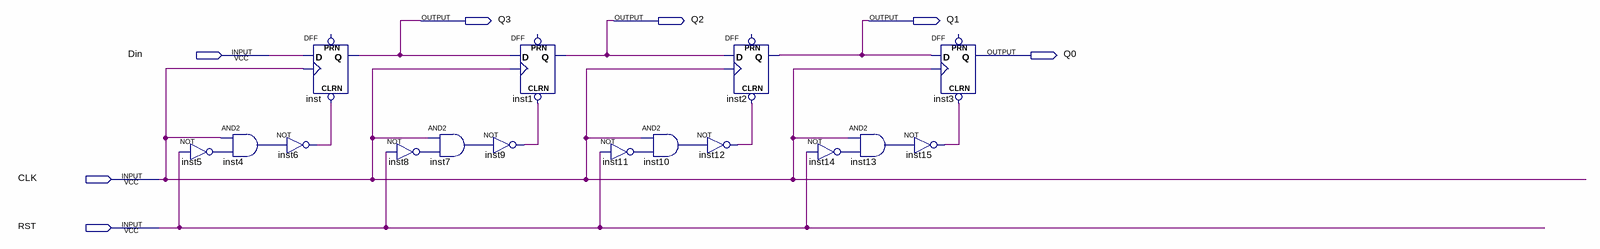
[diagram p0: schematic sheet]
// Quartus schematic four_synchronous_dff_synchronous_reset.bdf as structural Verilog: 16 symbols, 7 pins
module four_synchronous_dff_synchronous_reset (
  input  Din,
  input  CLK,
  input  RST,
  output Q3,
  output Q2,
  output Q1,
  output Q0
);

  wire inst4_out, inst5_out, inst6_out, inst7_out, inst8_out, inst9_out, inst10_out, inst11_out, inst12_out,
       inst13_out, inst14_out, inst15_out;

  not inst5 (inst5_out, RST);
  and inst4 (inst4_out, CLK, inst5_out);
  DFF inst (.CLRN(inst6_out), .CLK(CLK), .D(Din), .Q(Q3));  // open: PRN
  not inst6 (inst6_out, inst4_out);
  not inst8 (inst8_out, RST);
  and inst7 (inst7_out, CLK, inst8_out);
  DFF inst1 (.CLRN(inst9_out), .CLK(CLK), .D(Q3), .Q(Q2));  // open: PRN
  not inst9 (inst9_out, inst7_out);
  and inst10 (inst10_out, CLK, inst11_out);
  not inst11 (inst11_out, RST);
  not inst12 (inst12_out, inst10_out);
  DFF inst2 (.CLRN(inst12_out), .CLK(CLK), .D(Q2), .Q(Q1));  // open: PRN
  not inst14 (inst14_out, RST);
  and inst13 (inst13_out, CLK, inst14_out);
  not inst15 (inst15_out, inst13_out);
  DFF inst3 (.CLRN(inst15_out), .CLK(CLK), .D(Q1), .Q(Q0));  // open: PRN
endmodule
